# EAGLE schematic PARKPCB (EAGLE 9.3.0)
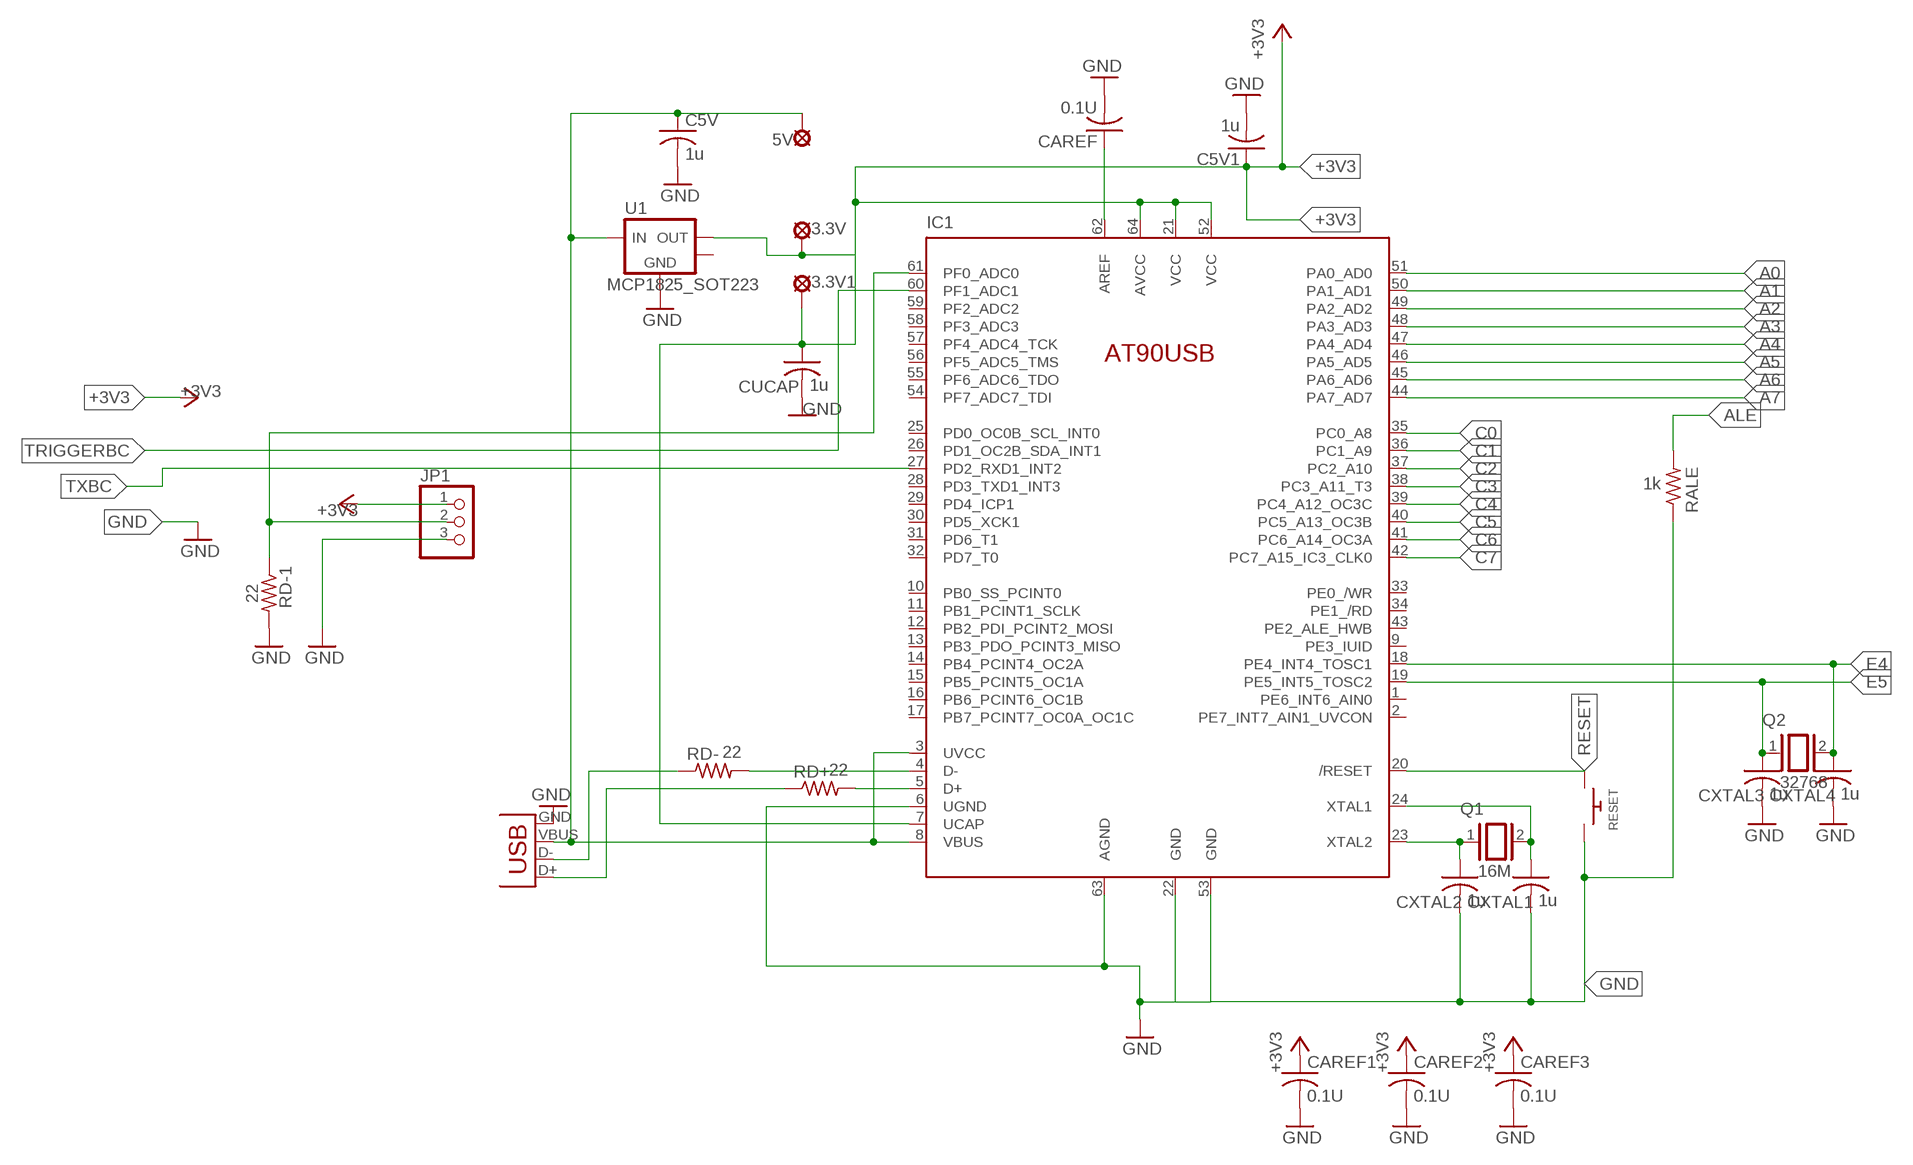
[diagram p0: schematic, sheet 1, part 1 of 2]
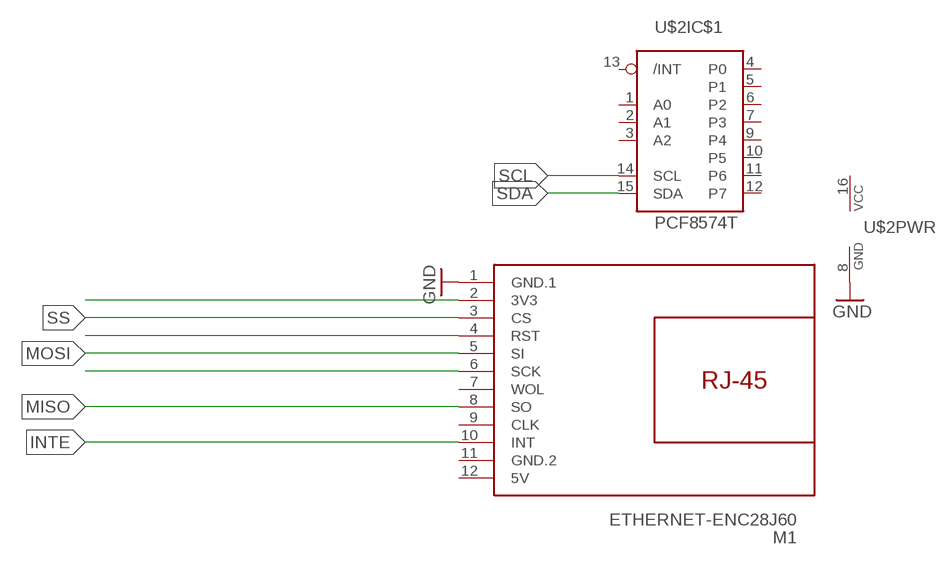
[diagram p1: schematic, sheet 1, part 2 of 2]

## Parts
3.3V  LSP10  [LSP10]
3.3V1  LSP10  [LSP10]
5V  LSP10  [LSP10]
C5V  1u  C-US050-030X075  [C050-030X075]
C5V1  1u  C-US050-030X075  [C050-030X075]
CAREF  0.1U  C-US050-030X075  [C050-030X075]
CAREF1  0.1U  C-US050-030X075  [C050-030X075]
CAREF2  0.1U  C-US050-030X075  [C050-030X075]
CAREF3  0.1U  C-US050-030X075  [C050-030X075]
CUCAP  1u  C-US050-030X075  [C050-030X075]
CXTAL1  1u  C-US050-030X075  [C050-030X075]
CXTAL2  1u  C-US050-030X075  [C050-030X075]
CXTAL3  1u  C-US050-030X075  [C050-030X075]
CXTAL4  1u  C-US050-030X075  [C050-030X075]
IC1  AT90USB-TQFP  [TQFP64]
JP1  PINHD-1X3  [1X03]
M1  ETHERNET-ENC28J60  [ETHERNET-ENC28J60]
Q1  16M  XTAL/S  [QS]
Q2  32768  XTAL/S  [QS]
RALE  1k  R-US_0309/12  [0309/12]
RD+  22  R-US_0309/12  [0309/12]
RD-  22  R-US_0309/12  [0309/12]
RD-1  22  R-US_0309/12  [0309/12]
RESET  SWITCH_PUSHBUTTONC&K_KSS  [BTN_CK_KSS]
U1  MCP1825_SOT223  [SOT-223-3]
U$2  PCF8574T  [SO16]
X1  USB-MB-S  [USB-MB-S]

## Nets
+3V3: 3.3V1.MP 3.3V.MP C5V1.1 CAREF1.1 CAREF2.1 CAREF3.1 CUCAP.1 IC1.7(UCAP) IC1.21(VCC) IC1.52(VCC) IC1.64(AVCC) JP1.1 U1.3(VOUT)
A0: IC1.51(PA0_AD0)
A1: IC1.50(PA1_AD1)
A2: IC1.49(PA2_AD2)
A3: IC1.48(PA3_AD3)
A4: IC1.47(PA4_AD4)
A5: IC1.46(PA5_AD5)
A6: IC1.45(PA6_AD6)
A7: IC1.44(PA7_AD7)
ALE: RALE.2
C0: IC1.35(PC0_A8)
C1: IC1.36(PC1_A9)
C2: IC1.37(PC2_A10)
C3: IC1.38(PC3_A11_T3)
C4: IC1.39(PC4_A12_OC3C)
C5: IC1.40(PC5_A13_OC3B)
C6: IC1.41(PC6_A14_OC3A)
C7: IC1.42(PC7_A15_IC3_CLK0)
E4: CXTAL4.1 IC1.18(PE4_INT4_TOSC1) Q2.2
E5: CXTAL3.1 IC1.19(PE5_INT5_TOSC2) Q2.1
GND: C5V1.2 C5V.2 CAREF1.2 CAREF2.2 CAREF3.2 CAREF.2 CUCAP.2 CXTAL1.2 CXTAL2.2 CXTAL3.2 CXTAL4.2 IC1.6(UGND) IC1.22(GND) IC1.53(GND) IC1.63(AGND) JP1.3 M1.1(GND.1) RALE.1 RD-1.2 RESET.P$2 U1.2(GND) U$2.8(PWR:GND) X1.GND
INTE: M1.10(INT)
MISO: M1.8(SO)
MOSI: M1.5(SI)
N$1: M1.2(3V3)
N$2: CAREF.1 IC1.62(AREF)
N$3: M1.4(RST)
N$4: 5V.MP C5V.1 IC1.3(UVCC) IC1.8(VBUS) U1.1(VIN) X1.VBUS
N$5: M1.6(SCK)
N$6: RD-.1 X1.D-
N$7: IC1.4(D-) RD-.2
N$8: RD+.1 X1.D+
N$11: IC1.5(D+) RD+.2
N$13: CXTAL2.1 IC1.23(XTAL2) Q1.1
N$14: CXTAL1.1 IC1.24(XTAL1) Q1.2
N$15: IC1.61(PF0_ADC0) JP1.2 RD-1.1
RESET: IC1.20(/RESET) RESET.P$1
SCL: U$2.14(IC$1:SCL)
SDA: U$2.15(IC$1:SDA)
SS: M1.3(CS)
TRIGGERBC: IC1.60(PF1_ADC1)
TXBC: IC1.27(PD2_RXD1_INT2)
Unconnected: IC1.1(PE6_INT6_AIN0) IC1.2(PE7_INT7_AIN1_UVCON) IC1.9(PE3_IUID) IC1.10(PB0_SS_PCINT0) IC1.11(PB1_PCINT1_SCLK) IC1.12(PB2_PDI_PCINT2_MOSI) IC1.13(PB3_PDO_PCINT3_MISO) IC1.14(PB4_PCINT4_OC2A) IC1.15(PB5_PCINT5_OC1A) IC1.16(PB6_PCINT6_OC1B) IC1.17(PB7_PCINT7_OC0A_OC1C) IC1.25(PD0_OC0B_SCL_INT0) IC1.26(PD1_OC2B_SDA_INT1) IC1.28(PD3_TXD1_INT3) IC1.29(PD4_ICP1) IC1.30(PD5_XCK1) IC1.31(PD6_T1) IC1.32(PD7_T0) IC1.33(PE0_/WR) IC1.34(PE1_/RD) IC1.43(PE2_ALE_HWB) IC1.54(PF7_ADC7_TDI) IC1.55(PF6_ADC6_TDO) IC1.56(PF5_ADC5_TMS) IC1.57(PF4_ADC4_TCK) IC1.58(PF3_ADC3) IC1.59(PF2_ADC2) M1.7(WOL) M1.9(CLK) U1.4(HEATSINK) U$2.1(IC$1:A0) U$2.2(IC$1:A1) U$2.3(IC$1:A2) U$2.4(IC$1:P0) U$2.5(IC$1:P1) U$2.6(IC$1:P2) U$2.7(IC$1:P3) U$2.9(IC$1:P4) U$2.10(IC$1:P5) U$2.11(IC$1:P6) U$2.12(IC$1:P7) U$2.13(IC$1:/INT)

## Power pins joined to a net without a drawn wire
5V: M1.12(5V)
GND.2: M1.11(GND.2)
VCC: U$2.16(PWR:VCC)

## Library data of the parts
3.3V 3.3V1 5V = solpad:LSP10: SOLDER PAD drill 1.0 mm, distributor Buerklin, 12H555
C5V C5V1 CAREF CAREF1-CAREF3 CUCAP CXTAL1-CXTAL4 = rcl:C-US: CAPACITOR, American symbol; SPICEPREFIX: C
IC1 = controller-micro_atmel_jd:AT90USB
JP1 = adafruit:PINHD-1X3: PIN HEADER
M1 = diy-modules:ETHERNET-ENC28J60: Ethernet Module based on ENC28J60 chip Click here to find device on ebay.com <http://www.ebay.com/sch/end28j60+ethernet+lan+module> Note: There are many variants. Search for the proper version.
Q1 Q2 = special:XTAL/S: CRYSTAL
RALE RD+ RD- RD-1 = rcl:R-US_: RESISTOR, American symbol; SPICEPREFIX: R
RESET = adafruit:SWITCH_PUSHBUTTON: Buttons SOFTTOUCHSMD_SJ - Soft touch temporary push button (Super Junk Akihabara) Compatible with SKPMANE010 [Mouser: 688-SKPMAN] C&K_KSS = Digikey: KSS221GLFS
U1 = bt_regulator:MCP1825: Microchip MCP1824 LDO Voltage Regulator The MCP1825/MCP1825S is a 500 mA Low Dropout (LDO) linear regulator that provides high current and low output voltages. Datasheet.pdf <http://ww1.microchip.com/downloads/en/DeviceDoc/22056b.pdf>
U$2 = i2c:PCF8574: Remote 8-Bit I/O Expander for I²C Bus
X1 = con-usb:USB: USB Connectors